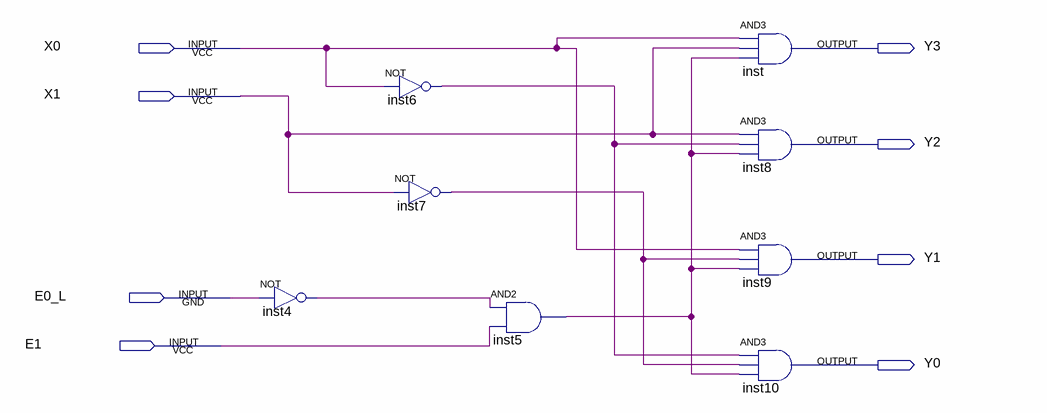
[diagram p0: schematic sheet]
// Quartus schematic DecoderDemo.bdf as structural Verilog: 8 symbols, 8 pins
module DecoderDemo (
  input  X0,
  input  X1,
  input  E0_L,
  input  E1,
  output Y3,
  output Y2,
  output Y1,
  output Y0
);

  wire inst4_out, inst5_out, inst6_out, inst7_out;

  not inst4 (inst4_out, E0_L);
  not inst6 (inst6_out, X0);
  not inst7 (inst7_out, X1);
  and inst5 (inst5_out, inst4_out, E1);
  and inst (Y3, X0, X1, inst5_out);
  and inst8 (Y2, X1, inst6_out, inst5_out);
  and inst9 (Y1, X0, inst7_out, inst5_out);
  and inst10 (Y0, inst6_out, inst7_out, inst5_out);
endmodule
